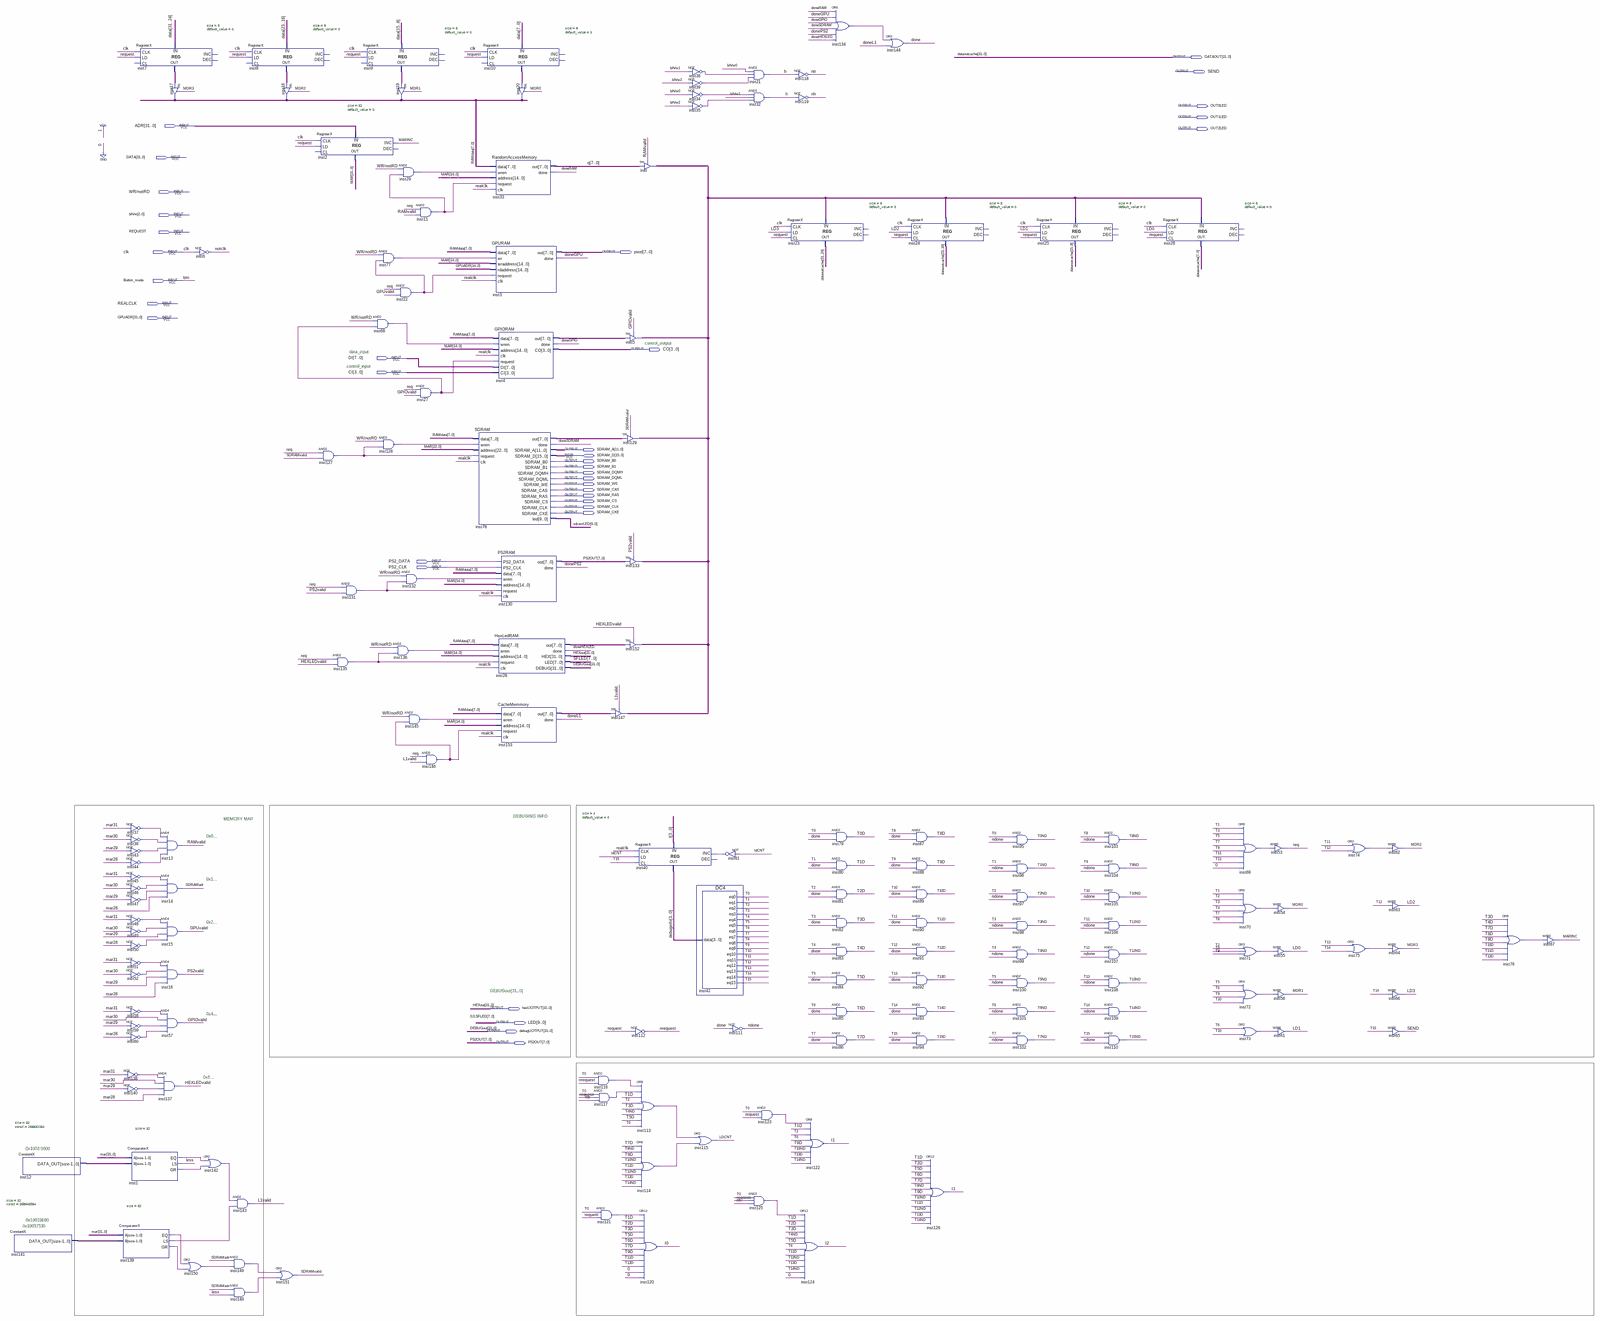
[diagram p0: schematic sheet, whole]
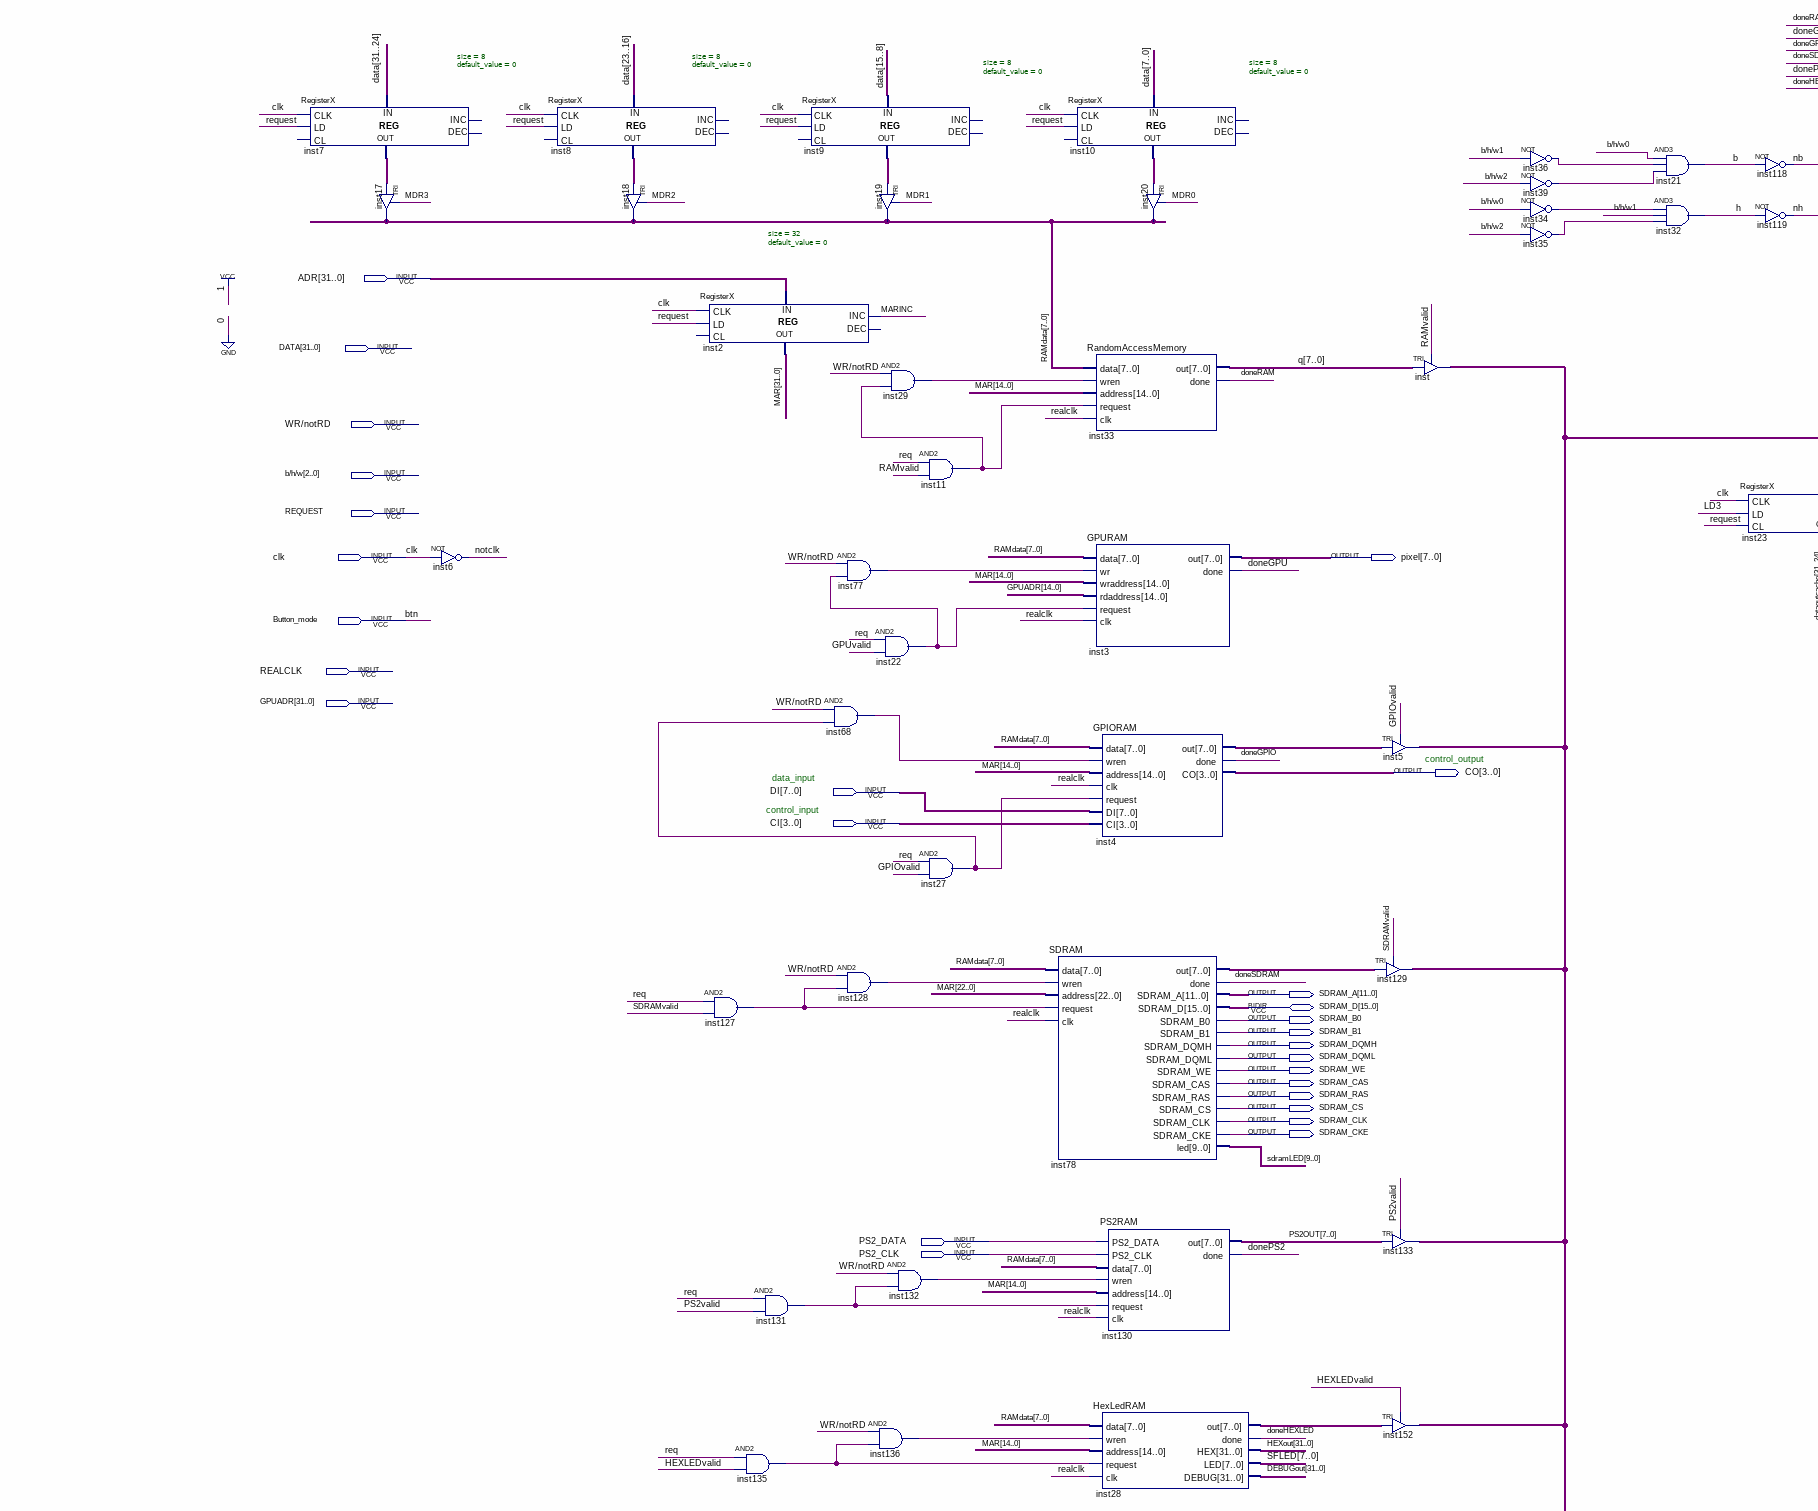
[diagram p1: schematic sheet, upper left part]
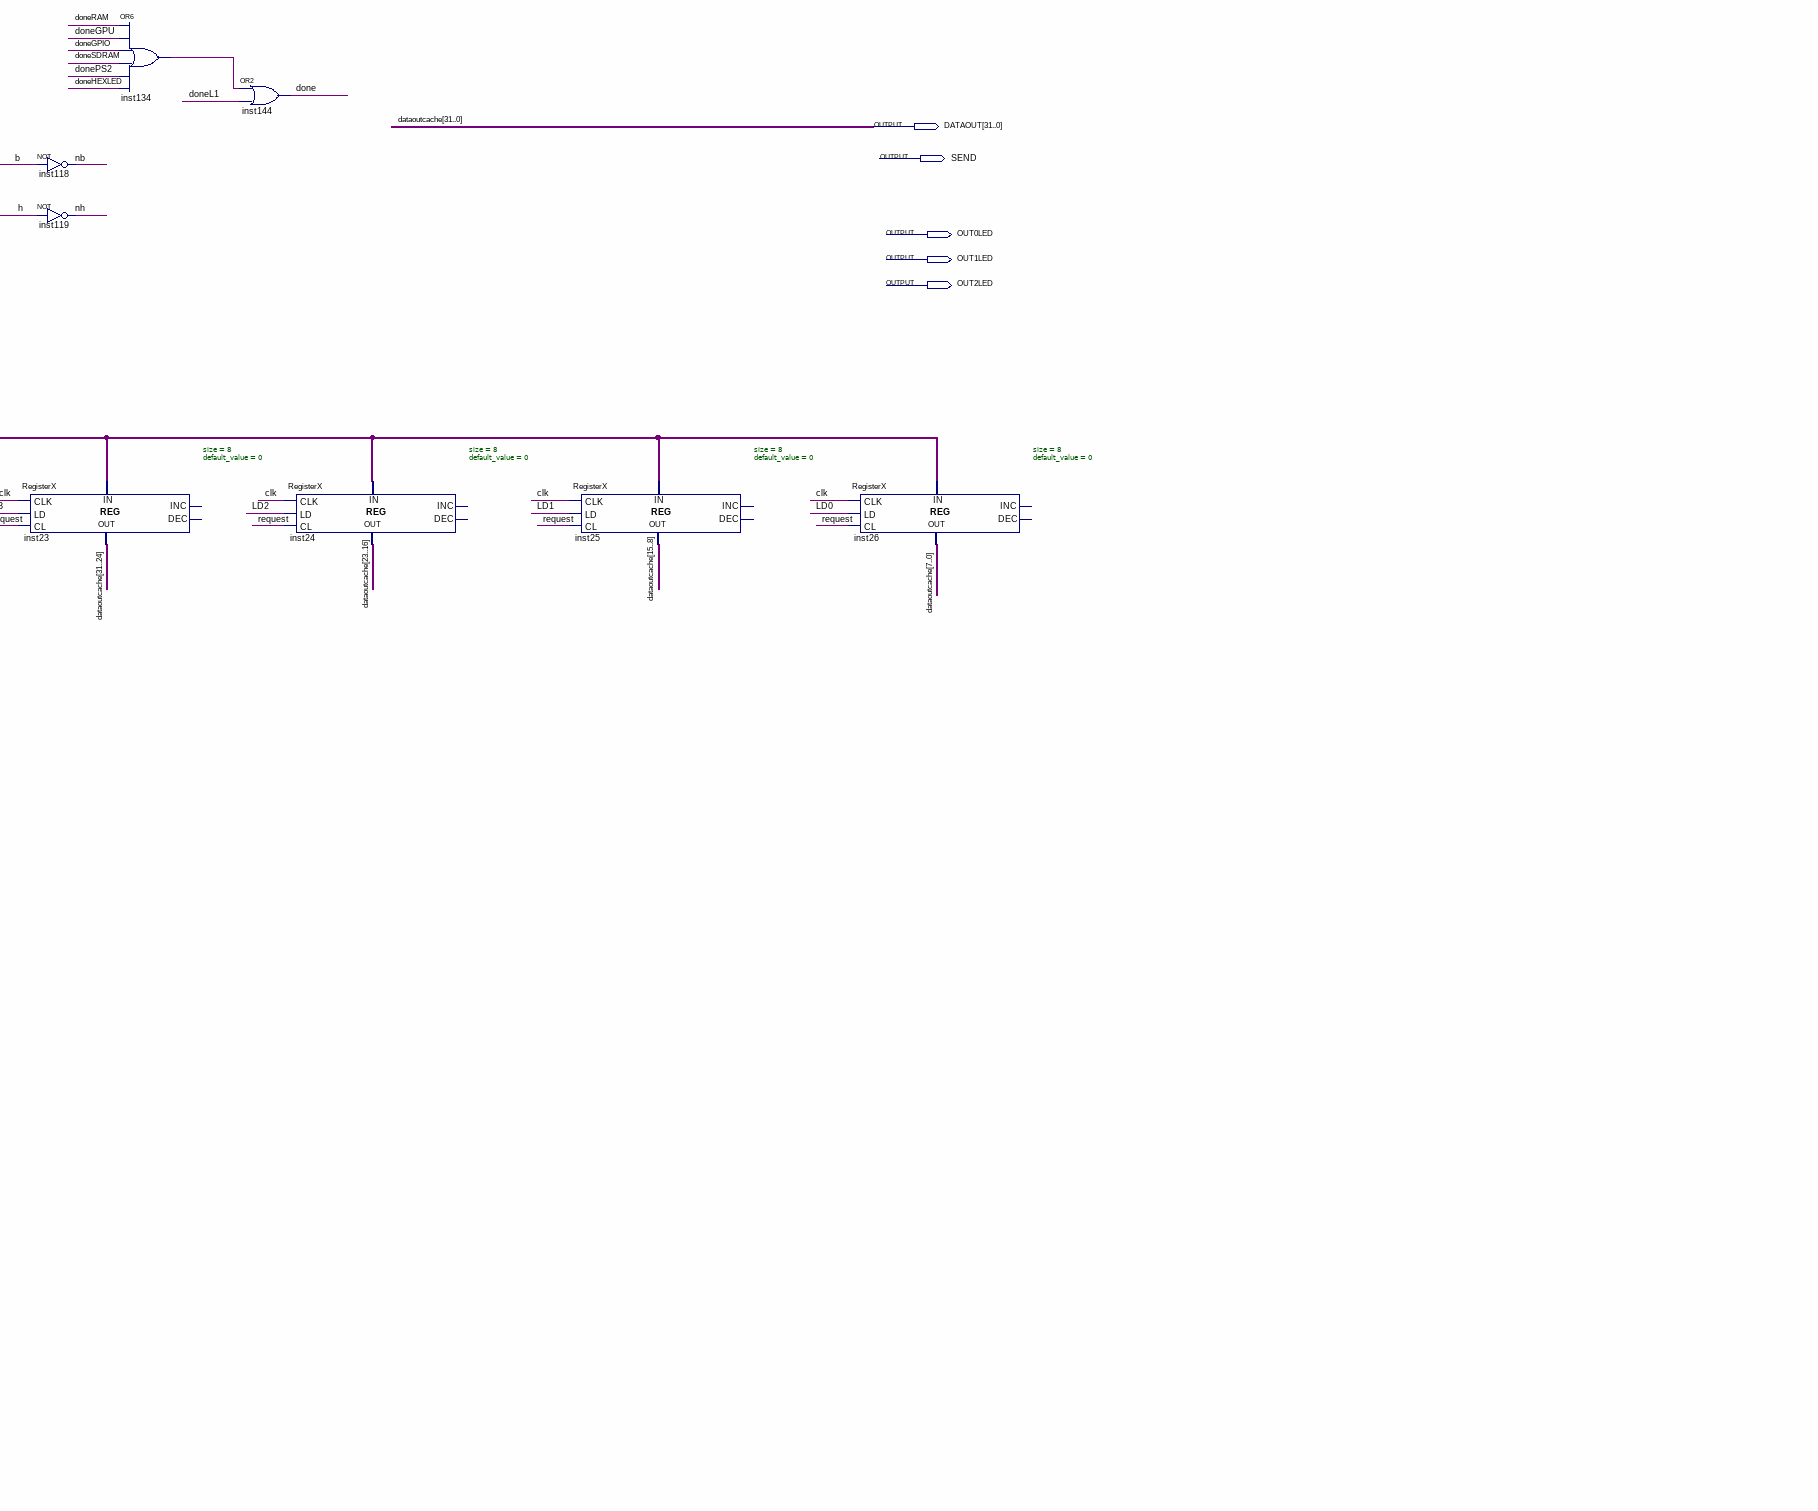
[diagram p2: schematic sheet, upper right part]
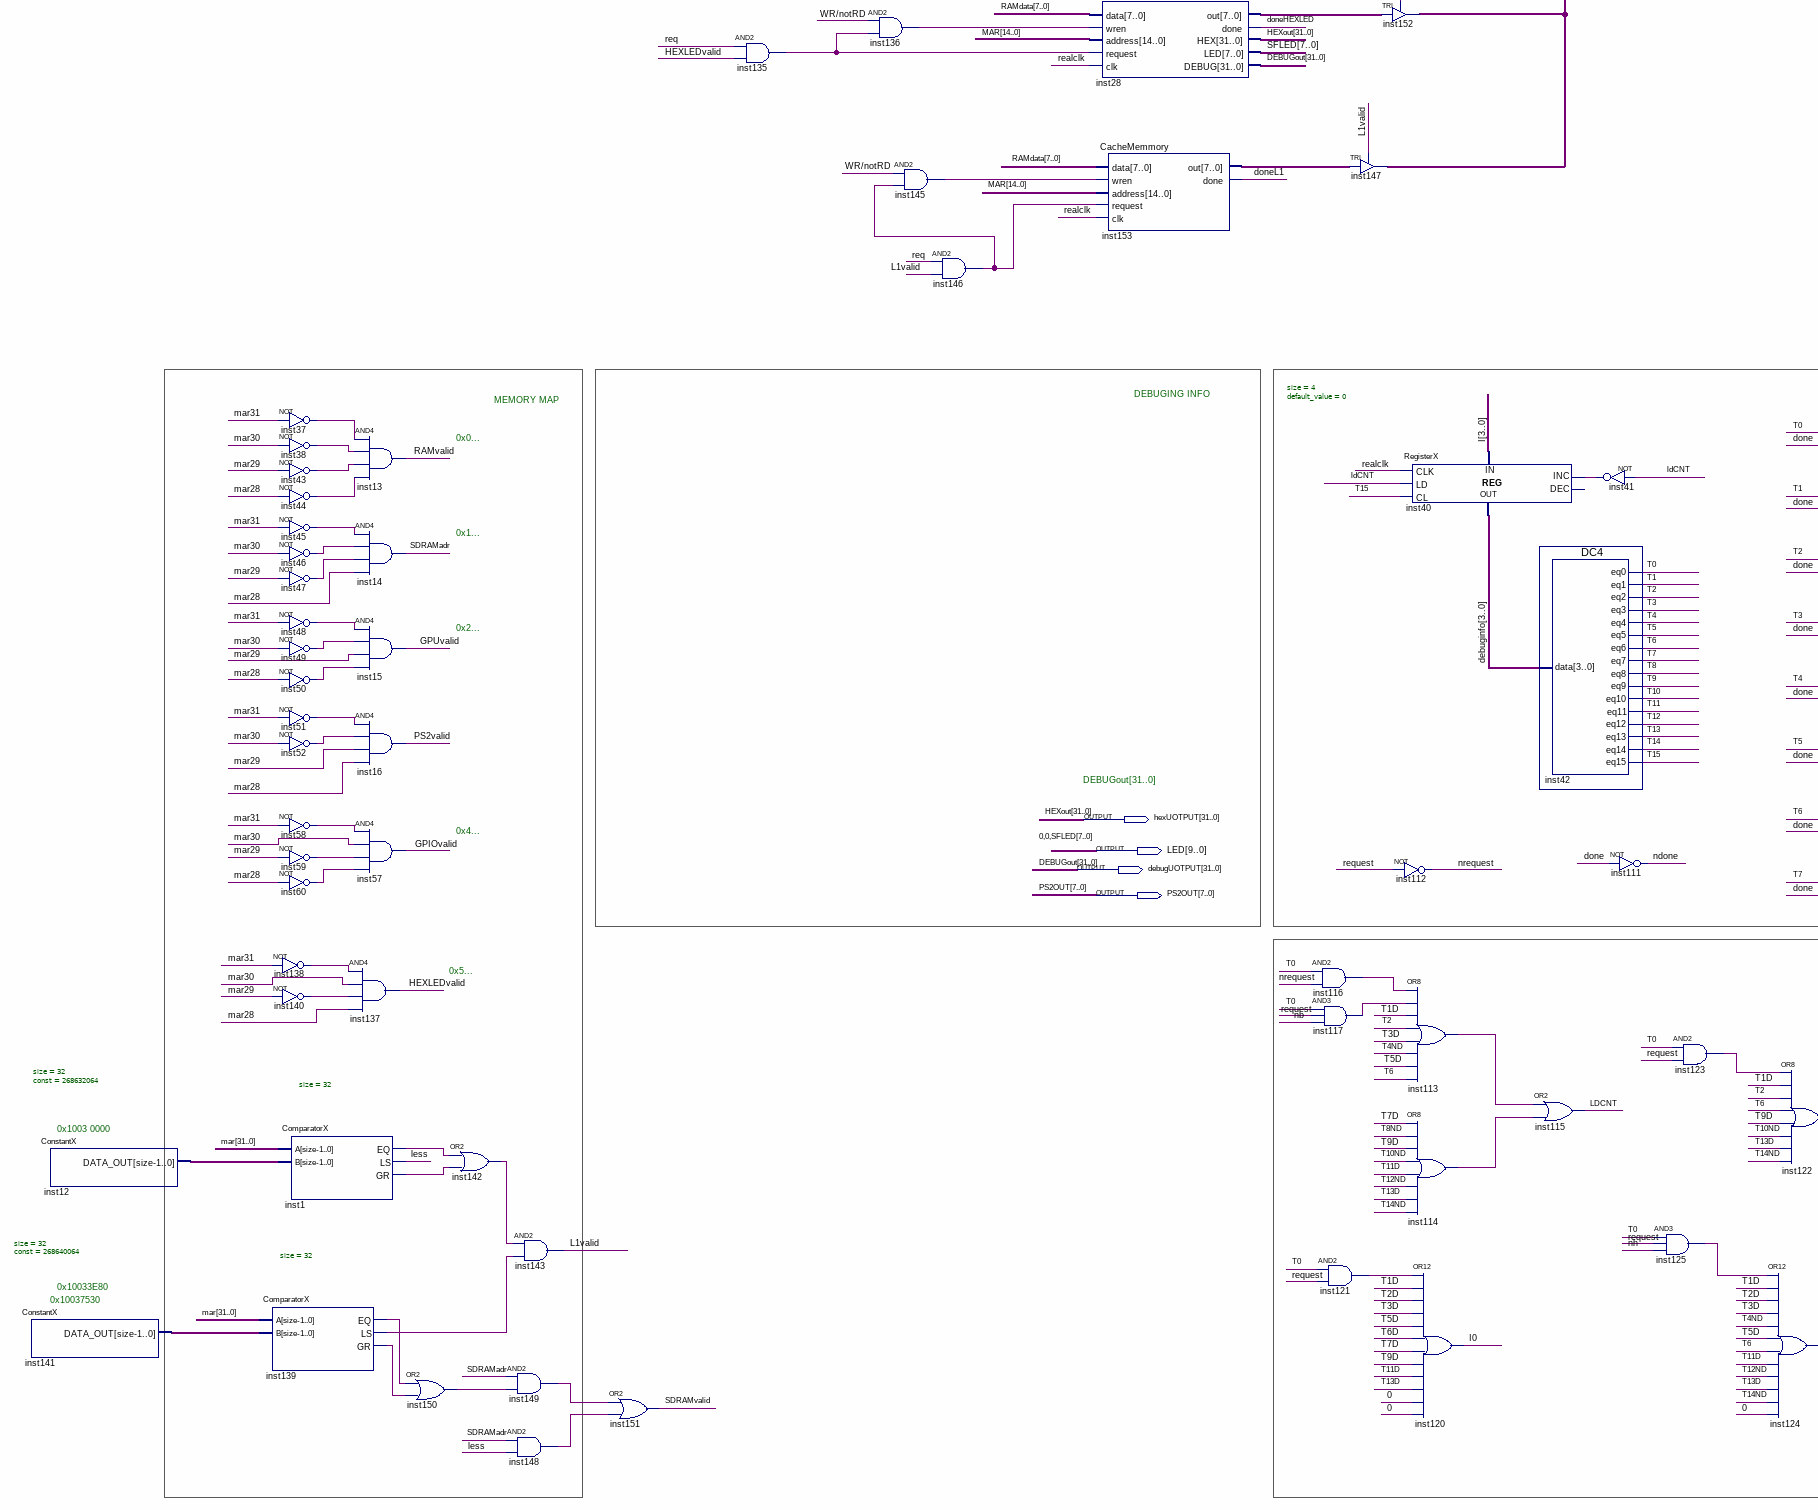
[diagram p3: schematic sheet, lower left part]
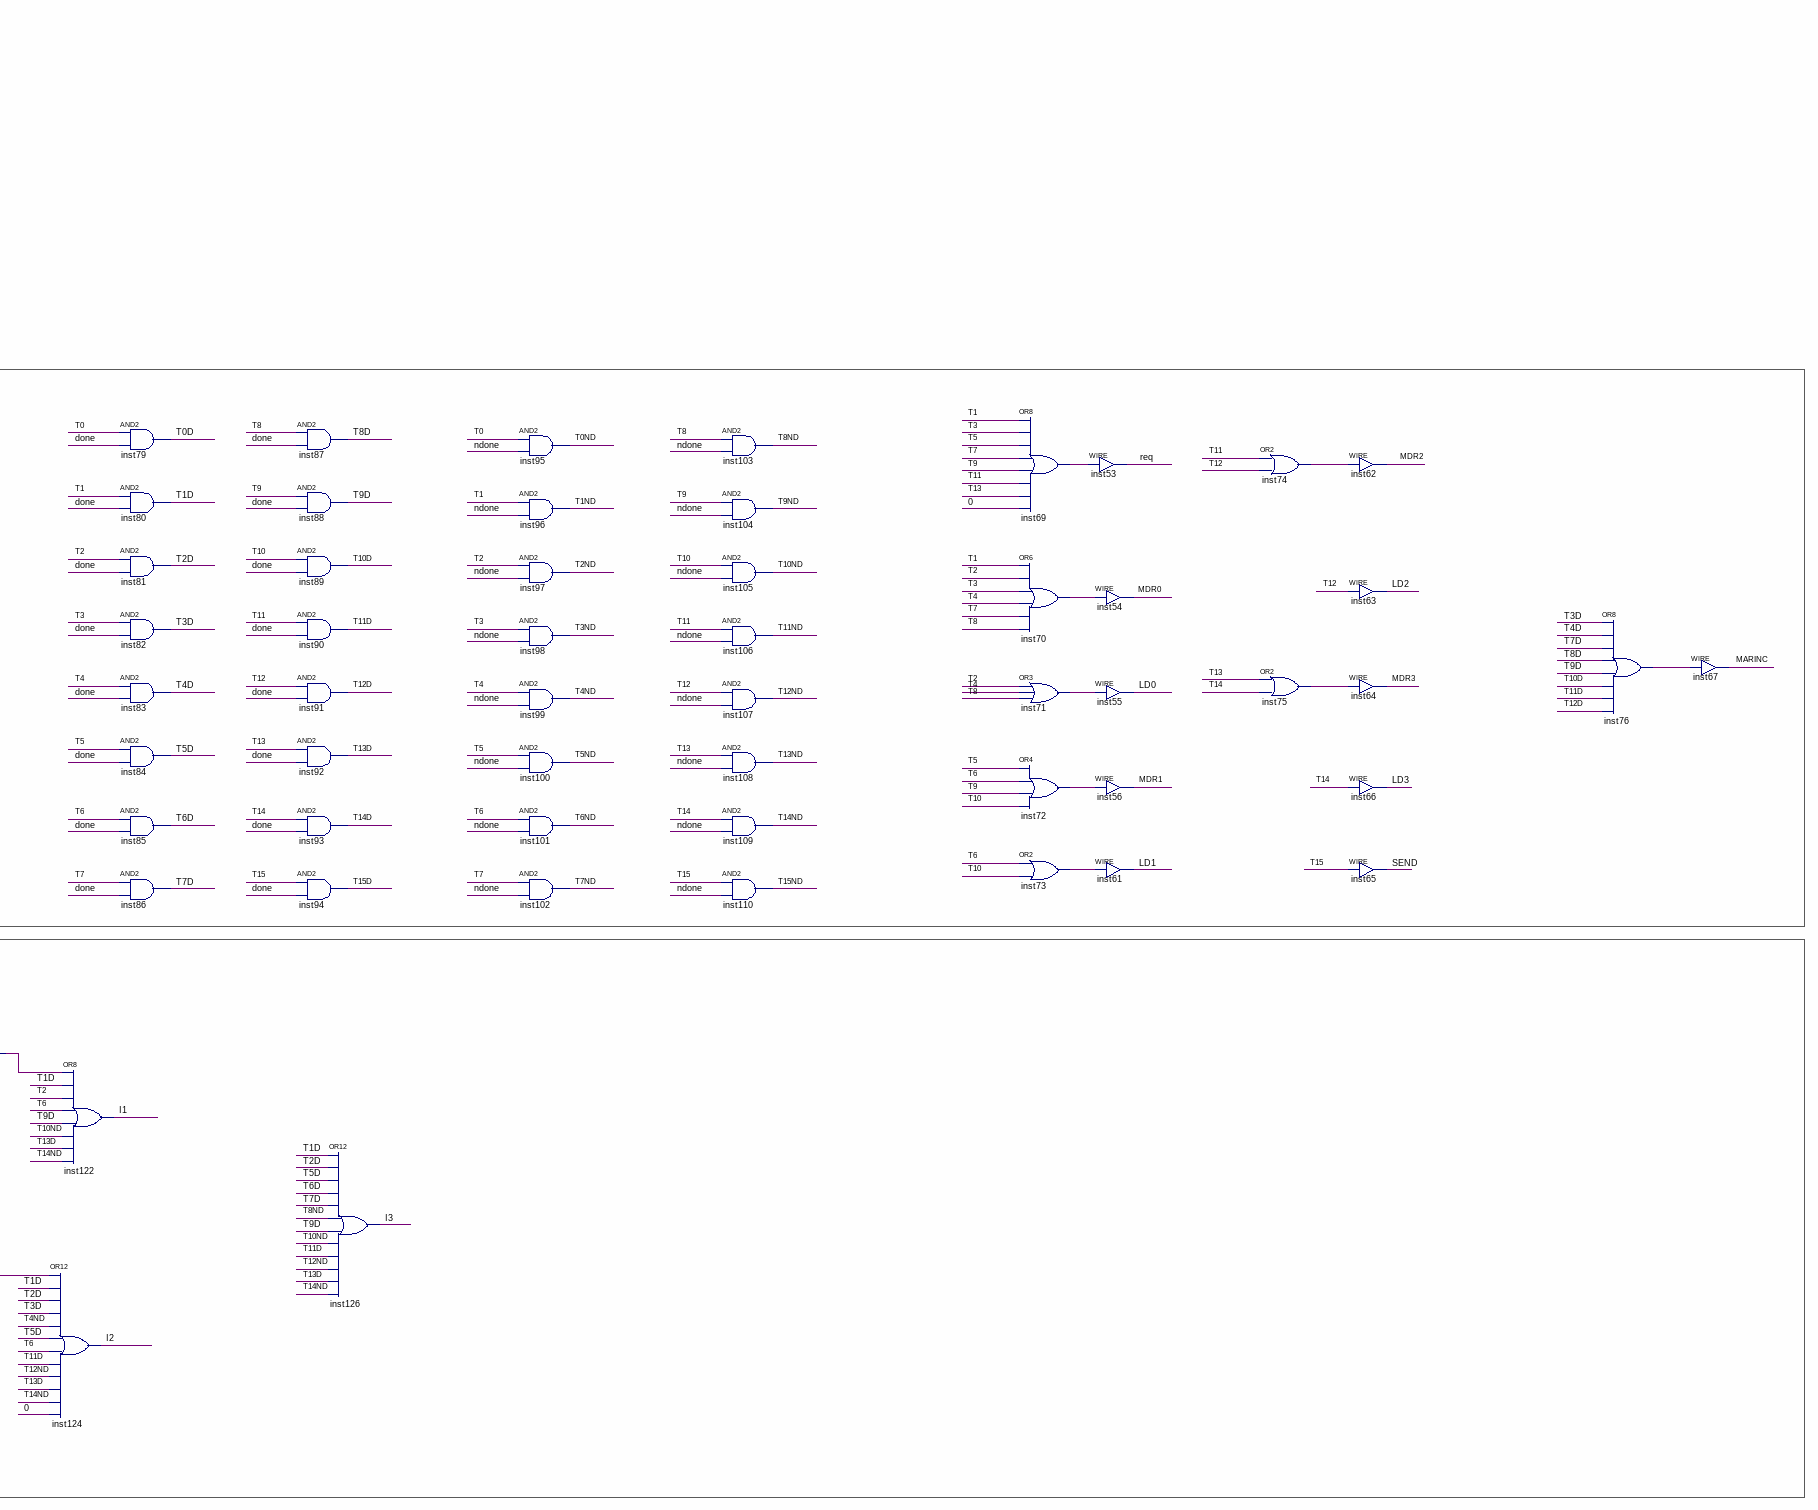
[diagram p4: schematic sheet, lower right part]
// Quartus schematic Memory.bdf as structural Verilog: 152 symbols, 36 pins
module Memory (
  input  [31:0] ADR,
  input  [31:0] DATA,
  input  \WR/notRD ,
  input  [2:0] \b/h/w ,
  input  REQUEST,
  input  clk,
  input  Button_mode,
  input  REALCLK,
  input  [31:0] GPUADR,
  input  [7:0] DI,
  input  [3:0] CI,
  input  PS2_DATA,
  input  PS2_CLK,
  inout  [15:0] SDRAM_D,
  output [31:0] DATAOUT,
  output SEND,
  output OUT0LED,
  output OUT1LED,
  output OUT2LED,
  output [7:0] pixel,
  output [3:0] CO,
  output [11:0] SDRAM_A,
  output SDRAM_B0,
  output SDRAM_B1,
  output SDRAM_DQMH,
  output SDRAM_DQML,
  output SDRAM_WE,
  output SDRAM_CAS,
  output SDRAM_RAS,
  output SDRAM_CS,
  output SDRAM_CLK,
  output SDRAM_CKE,
  output [31:0] hexUOTPUT,
  output [9:0] LED,
  output [31:0] debugUOTPUT,
  output [7:0] PS2OUT
);

  wire b, done, doneGPIO, doneGPU, doneHEXLED, doneL1, donePS2, doneRAM, doneSDRAM, GPIOvalid, GPUvalid, h,
       HEXLEDvalid, inst1_eq, inst1_gr, inst11_out, inst22_out, inst27_out, inst29_out, inst34_out,
       inst35_out, inst36_out, inst37_out, inst38_out, inst39_out, inst41_out, inst43_out, inst44_out,
       inst45_out, inst46_out, inst47_out, inst48_out, inst49_out, inst50_out, inst51_out, inst52_out,
       inst58_out, inst59_out, inst60_out, inst68_out, inst69_out, inst70_out, inst71_out, inst72_out,
       inst73_out, inst74_out, inst75_out, inst76_out, inst77_out, inst113_out, inst114_out, inst116_out,
       inst117_out, inst121_out, inst123_out, inst125_out, inst127_out, inst128_out, inst131_out,
       inst132_out, inst134_out, inst135_out, inst136_out, inst138_out, inst139_eq, inst139_gr, inst139_ls,
       inst140_out, inst142_out, inst145_out, inst146_out, inst148_out, inst149_out, inst150_out, L1valid,
       LD0, LD1, LD2, LD3, LDCNT, less, MARINC, MDR0, MDR1, MDR2, MDR3, nb, ndone, nh, notclk, nrequest,
       PS2valid, RAMvalid, req, SDRAMadr, SDRAMvalid, T0, T0D, T0ND, T1, T1D, T1ND, T2, T2D, T2ND, T3, T3D,
       T3ND, T4, T4D, T4ND, T5, T5D, T5ND, T6, T6D, T6ND, T7, T7D, T7ND, T8, T8D, T8ND, T9, T9D, T9ND, T10,
       T10D, T10ND, T11, T11D, T11ND, T12, T12D, T12ND, T13, T13D, T13ND, T14, T14D, T14ND, T15, T15D, T15ND;
  wire [3:0] debuginfo, I;
  wire [7:0] inst4_out, inst7_data_out, inst8_data_out, inst9_data_out, inst10_data_out, inst28_out,
       inst78_out, inst147_out, inst153_out, q, RAMdata;
  wire [9:0] sdramLED;
  wire [31:0] inst12_data_out, inst141_data_out, MAR;

  ConstantX #(.size(32), .\const (268640064)) inst141 (.DATA_OUT(inst141_data_out));
  ConstantX #(.size(32), .\const (268632064)) inst12 (.DATA_OUT(inst12_data_out));
  not inst37 (inst37_out, MAR[31]);
  not inst38 (inst38_out, MAR[30]);
  not inst43 (inst43_out, MAR[29]);
  not inst44 (inst44_out, MAR[28]);
  not inst45 (inst45_out, MAR[31]);
  not inst46 (inst46_out, MAR[30]);
  not inst47 (inst47_out, MAR[29]);
  not inst48 (inst48_out, MAR[31]);
  not inst49 (inst49_out, MAR[30]);
  not inst50 (inst50_out, MAR[28]);
  not inst51 (inst51_out, MAR[31]);
  not inst52 (inst52_out, MAR[30]);
  not inst58 (inst58_out, MAR[31]);
  not inst59 (inst59_out, MAR[29]);
  not inst60 (inst60_out, MAR[28]);
  not inst138 (inst138_out, MAR[31]);
  not inst140 (inst140_out, MAR[29]);
  ComparatorX #(.size(32)) inst1 (.A(MAR), .B(inst12_data_out), .EQ(inst1_eq), .LS(less), .GR(inst1_gr));
  ComparatorX #(.size(32)) inst139 (.A(MAR), .B(inst141_data_out), .EQ(inst139_eq), .LS(inst139_ls), .GR(inst139_gr));
  RegisterX #(.size(8), .default_value(0)) inst7 (
    .CLK(clk), .LD(REQUEST), .DATA_IN(DATA[31:24]), .DATA_OUT(inst7_data_out));  // open: CL, INC, DEC
  TRI inst17[7:0] (.IN(inst7_data_out), .OE(MDR3), .OUT(RAMdata));
  and inst13 (RAMvalid, inst37_out, inst38_out, inst43_out, inst44_out);
  and inst14 (SDRAMadr, inst45_out, inst46_out, inst47_out, MAR[28]);
  and inst15 (GPUvalid, inst48_out, inst49_out, MAR[29], inst50_out);
  and inst16 (PS2valid, inst51_out, inst52_out, MAR[29], MAR[28]);
  and inst57 (GPIOvalid, inst58_out, MAR[30], inst59_out, inst60_out);
  and inst137 (HEXLEDvalid, inst138_out, MAR[30], inst140_out, MAR[28]);
  not inst6 (notclk, clk);
  or inst150 (inst150_out, inst139_eq, inst139_gr);
  or inst142 (inst142_out, inst1_eq, inst1_gr);
  and inst143 (L1valid, inst142_out, inst139_ls);
  and inst149 (inst149_out, SDRAMadr, inst150_out);
  and inst148 (inst148_out, SDRAMadr, less);
  RegisterX #(.size(8), .default_value(0)) inst8 (
    .CLK(clk), .LD(REQUEST), .DATA_IN(DATA[23:16]), .DATA_OUT(inst8_data_out));  // open: CL, INC, DEC
  TRI inst18[7:0] (.IN(inst8_data_out), .OE(MDR2), .OUT(RAMdata));
  or inst151 (SDRAMvalid, inst149_out, inst148_out);
  RegisterX #(.size(32), .default_value(0)) inst2 (
    .CLK(clk), .LD(REQUEST), .INC(MARINC), .DATA_IN(ADR), .DATA_OUT(MAR));  // open: CL, DEC
  and inst127 (inst127_out, req, SDRAMvalid);
  and inst135 (inst135_out, req, HEXLEDvalid);
  and inst131 (inst131_out, req, PS2valid);
  RegisterX #(.size(8), .default_value(0)) inst9 (
    .CLK(clk), .LD(REQUEST), .DATA_IN(DATA[15:8]), .DATA_OUT(inst9_data_out));  // open: CL, INC, DEC
  and inst77 (inst77_out, \WR/notRD , inst22_out);
  and inst68 (inst68_out, \WR/notRD , inst27_out);
  and inst128 (inst128_out, \WR/notRD , inst127_out);
  TRI inst19[7:0] (.IN(inst9_data_out), .OE(MDR1), .OUT(RAMdata));
  and inst29 (inst29_out, \WR/notRD , inst11_out);
  and inst22 (inst22_out, req, GPUvalid);
  and inst132 (inst132_out, \WR/notRD , inst131_out);
  and inst136 (inst136_out, \WR/notRD , inst135_out);
  and inst145 (inst145_out, \WR/notRD , inst146_out);
  and inst11 (inst11_out, req, RAMvalid);
  and inst27 (inst27_out, req, GPIOvalid);
  and inst146 (inst146_out, req, L1valid);
  SDRAM inst78 (
    .data(RAMdata), .wren(inst128_out), .address(MAR[22:0]), .request(inst127_out), .clk(REALCLK),
    .out(inst78_out), .done(doneSDRAM), .SDRAM_A(SDRAM_A), .SDRAM_B0(SDRAM_B0), .SDRAM_B1(SDRAM_B1),
    .SDRAM_DQMH(SDRAM_DQMH), .SDRAM_DQML(SDRAM_DQML), .SDRAM_WE(SDRAM_WE), .SDRAM_CAS(SDRAM_CAS),
    .SDRAM_RAS(SDRAM_RAS), .SDRAM_CS(SDRAM_CS), .SDRAM_CLK(SDRAM_CLK), .SDRAM_CKE(SDRAM_CKE), .led(sdramLED),
    .SDRAM_D(SDRAM_D));
  RegisterX #(.size(8), .default_value(0)) inst10 (
    .CLK(clk), .LD(REQUEST), .DATA_IN(DATA[7:0]), .DATA_OUT(inst10_data_out));  // open: CL, INC, DEC
  RandomAccessMemory inst33 (
    .data(RAMdata), .wren(inst29_out), .address(MAR[14:0]), .request(inst11_out), .clk(REALCLK), .out(q),
    .done(doneRAM));
  GPURAM inst3 (
    .data(RAMdata), .wr(inst77_out), .wraddress(MAR[14:0]), .rdaddress(GPUADR[14:0]), .request(inst22_out),
    .clk(REALCLK), .out(pixel), .done(doneGPU));
  GPIORAM inst4 (
    .data(RAMdata), .wren(inst68_out), .address(MAR[14:0]), .clk(REALCLK), .request(inst27_out), .DI(DI),
    .CI(CI), .out(inst4_out), .done(doneGPIO), .CO(CO));
  PS2RAM inst130 (
    .PS2_DATA(PS2_DATA), .PS2_CLK(PS2_CLK), .data(RAMdata), .wren(inst132_out), .address(MAR[14:0]),
    .request(inst131_out), .clk(REALCLK), .out(PS2OUT), .done(donePS2));
  HexLedRAM inst28 (
    .data(RAMdata), .wren(inst136_out), .address(MAR[14:0]), .request(inst135_out), .clk(REALCLK),
    .out(inst28_out), .done(doneHEXLED), .HEX(hexUOTPUT), .LED(LED[7:0]), .DEBUG(debugUOTPUT));
  CacheMemmory inst153 (
    .data(RAMdata), .wren(inst145_out), .address(MAR[14:0]), .request(inst146_out), .clk(REALCLK),
    .out(inst153_out), .done(doneL1));
  TRI inst20[7:0] (.IN(inst10_data_out), .OE(MDR0), .OUT(RAMdata));
  TRI inst147[7:0] (.IN(inst153_out), .OE(L1valid), .OUT(inst147_out));
  and inst116 (inst116_out, T0, nrequest);
  and inst117 (inst117_out, T0, REQUEST, nb);
  and inst121 (inst121_out, T0, REQUEST);
  TRI inst5[7:0] (.IN(inst4_out), .OE(GPIOvalid), .OUT(inst147_out));
  TRI inst129[7:0] (.IN(inst78_out), .OE(SDRAMvalid), .OUT(inst147_out));
  TRI inst133[7:0] (.IN(PS2OUT), .OE(PS2valid), .OUT(inst147_out));
  TRI inst152[7:0] (.IN(inst28_out), .OE(HEXLEDvalid), .OUT(inst147_out));
  RegisterX #(.size(4), .default_value(0)) inst40 (
    .CLK(REALCLK), .LD(LDCNT), .CL(T15), .INC(inst41_out), .DATA_IN(I), .DATA_OUT(debuginfo));  // open: DEC
  not inst112 (nrequest, REQUEST);
  TRI inst[7:0] (.IN(q), .OE(RAMvalid), .OUT(inst147_out));
  or inst113 (inst113_out, inst116_out, inst117_out, T1D, T2, T3D, T4ND, T5D, T6);
  or inst114 (inst114_out, T7D, T8ND, T9D, T10ND, T11D, T12ND, T13D, T14ND);
  or inst120 (I[0], inst121_out, T1D, T2D, T3D, T5D, T6D, T7D, T9D, T11D, T13D, 1'b0, 1'b0);
  not inst36 (inst36_out, \b/h/w [1]);
  not inst39 (inst39_out, \b/h/w [2]);
  not inst34 (inst34_out, \b/h/w [0]);
  not inst35 (inst35_out, \b/h/w [2]);
  DC4 inst42 (
    .data(debuginfo), .eq0(T0), .eq1(T1), .eq2(T2), .eq3(T3), .eq4(T4), .eq5(T5), .eq6(T6), .eq7(T7),
    .eq8(T8), .eq9(T9), .eq10(T10), .eq11(T11), .eq12(T12), .eq13(T13), .eq14(T14), .eq15(T15));
  or inst115 (LDCNT, inst113_out, inst114_out);
  not inst41 (inst41_out, LDCNT);
  and inst21 (b, \b/h/w [0], inst36_out, inst39_out);
  and inst32 (h, inst34_out, \b/h/w [1], inst35_out);
  not inst111 (ndone, done);
  and inst125 (inst125_out, T0, REQUEST, nh);
  and inst123 (inst123_out, T0, REQUEST);
  not inst118 (nb, b);
  not inst119 (nh, h);
  RegisterX #(.size(8), .default_value(0)) inst23 (
    .CLK(clk), .LD(LD3), .CL(REQUEST), .DATA_IN(inst147_out), .DATA_OUT(DATAOUT[31:24]));  // open: INC, DEC
  or inst122 (I[1], inst123_out, T1D, T2, T6, T9D, T10ND, T13D, T14ND);
  or inst124 (I[2], inst125_out, T1D, T2D, T3D, T4ND, T5D, T6, T11D, T12ND, T13D, T14ND, 1'b0);
  or inst134 (inst134_out, doneRAM, doneGPU, doneGPIO, doneSDRAM, donePS2, doneHEXLED);
  and inst79 (T0D, T0, done);
  and inst80 (T1D, T1, done);
  and inst81 (T2D, T2, done);
  and inst82 (T3D, T3, done);
  and inst83 (T4D, T4, done);
  and inst84 (T5D, T5, done);
  and inst85 (T6D, T6, done);
  and inst86 (T7D, T7, done);
  or inst144 (done, inst134_out, doneL1);
  RegisterX #(.size(8), .default_value(0)) inst24 (
    .CLK(clk), .LD(LD2), .CL(REQUEST), .DATA_IN(inst147_out), .DATA_OUT(DATAOUT[23:16]));  // open: INC, DEC
  and inst87 (T8D, T8, done);
  and inst88 (T9D, T9, done);
  and inst89 (T10D, T10, done);
  and inst90 (T11D, T11, done);
  and inst91 (T12D, T12, done);
  and inst92 (T13D, T13, done);
  and inst93 (T14D, T14, done);
  and inst94 (T15D, T15, done);
  or inst126 (I[3], T1D, T2D, T5D, T6D, T7D, T8ND, T9D, T10ND, T11D, T12ND, T13D, T14ND);
  and inst95 (T0ND, T0, ndone);
  and inst96 (T1ND, T1, ndone);
  and inst97 (T2ND, T2, ndone);
  and inst98 (T3ND, T3, ndone);
  and inst99 (T4ND, T4, ndone);
  and inst100 (T5ND, T5, ndone);
  and inst101 (T6ND, T6, ndone);
  and inst102 (T7ND, T7, ndone);
  RegisterX #(.size(8), .default_value(0)) inst25 (
    .CLK(clk), .LD(LD1), .CL(REQUEST), .DATA_IN(inst147_out), .DATA_OUT(DATAOUT[15:8]));  // open: INC, DEC
  and inst103 (T8ND, T8, ndone);
  and inst104 (T9ND, T9, ndone);
  and inst105 (T10ND, T10, ndone);
  and inst106 (T11ND, T11, ndone);
  and inst107 (T12ND, T12, ndone);
  and inst108 (T13ND, T13, ndone);
  and inst109 (T14ND, T14, ndone);
  and inst110 (T15ND, T15, ndone);
  RegisterX #(.size(8), .default_value(0)) inst26 (
    .CLK(clk), .LD(LD0), .CL(REQUEST), .DATA_IN(inst147_out), .DATA_OUT(DATAOUT[7:0]));  // open: INC, DEC
  or inst69 (inst69_out, T1, T3, T5, T7, T9, T11, T13, 1'b0);
  or inst70 (inst70_out, T1, T2, T3, T4, T7, T8);
  or inst71 (inst71_out, T2, T4, T8);
  or inst72 (inst72_out, T5, T6, T9, T10);
  or inst73 (inst73_out, T6, T10);
  assign req = inst69_out;  // WIRE inst53
  assign MDR0 = inst70_out;  // WIRE inst54
  assign LD0 = inst71_out;  // WIRE inst55
  assign MDR1 = inst72_out;  // WIRE inst56
  assign LD1 = inst73_out;  // WIRE inst61
  or inst74 (inst74_out, T11, T12);
  or inst75 (inst75_out, T13, T14);
  assign MDR2 = inst74_out;  // WIRE inst62
  assign LD2 = T12;  // WIRE inst63
  assign MDR3 = inst75_out;  // WIRE inst64
  assign LD3 = T14;  // WIRE inst66
  assign SEND = T15;  // WIRE inst65
  or inst76 (inst76_out, T3D, T4D, T7D, T8D, T9D, T10D, T11D, T12D);
  assign MARINC = inst76_out;  // WIRE inst67

  assign LED[9:8] = 2'b00;

  // Other names for the same wires on the sheet: btn = Button_mode; dataoutcache[31:0] = DATAOUT;
  //   DEBUGout[31:0] = debugUOTPUT; HEXout[31:0] = hexUOTPUT; SFLED[7:0] = LED[7:0]

  // Notes on the sheet:
  //   control_output
  //   data_input
  //   control_input
  //   DEBUGING INFO
  //   MEMORY MAP
  //   0x0...
  //   0x1...
  //   0x2...
  //   DEBUGout[31..0]
  //   0x4...
  //   0x5...
  //   0x1003 0000
  //   0x10033E80
  //   0x10037530
endmodule
